# Altium schematic sheet Sheet1.SchDoc
size 381 x 241 mm; SheetNumber: 1; SheetTotal: 1
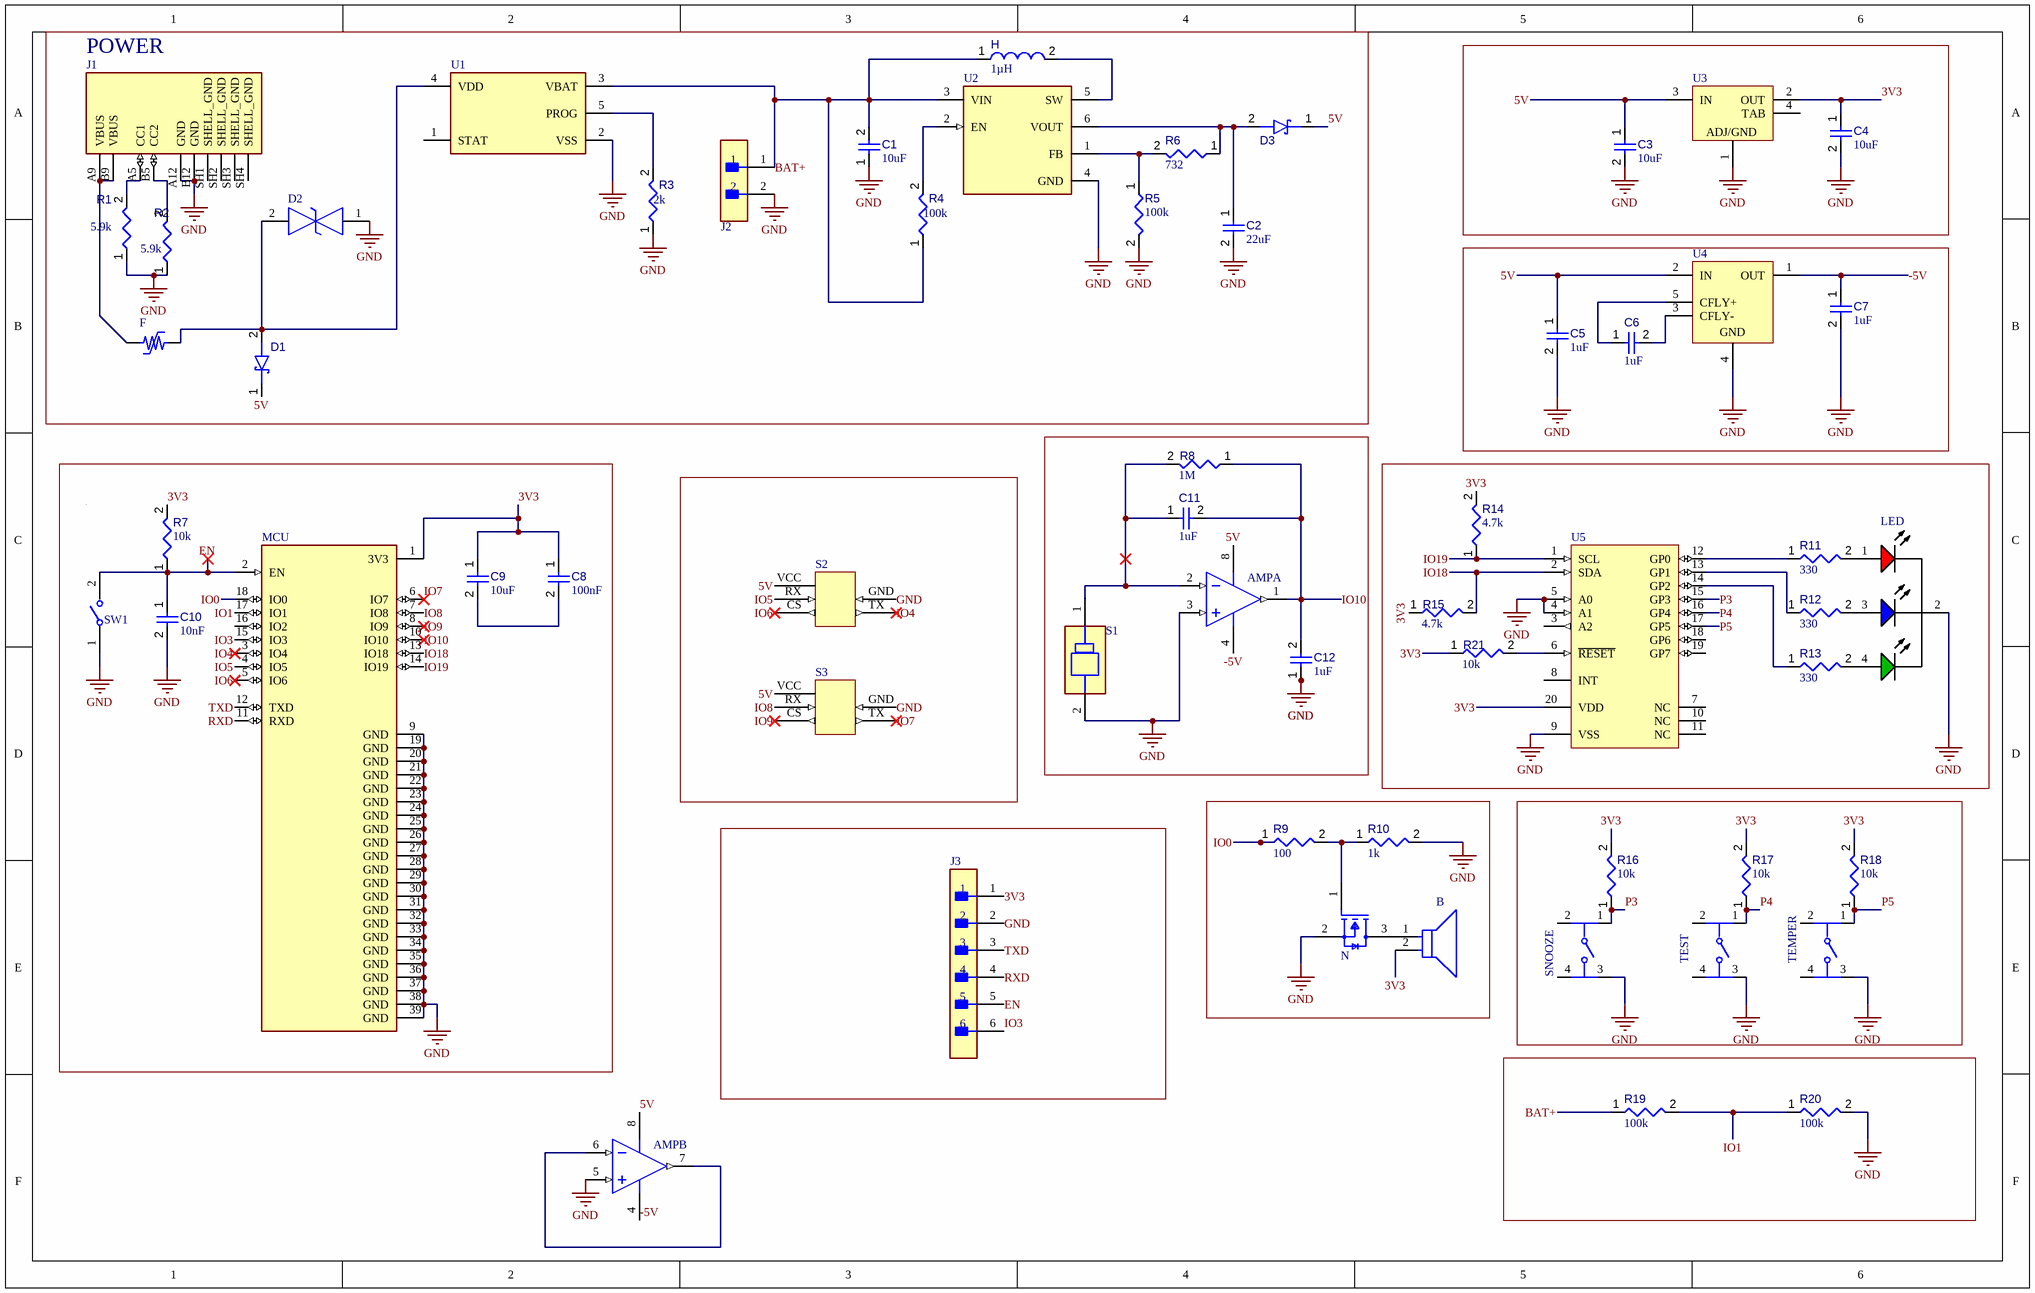
[diagram p0: Sheet1.SchDoc]

## Parts
AMP  AD708SQ/883B  [ADI-Q-8]  (value not drawn)  (parts A,B of 2)
B  PS1740P02E  [FP-PS1740P02E-MFG]  (value not drawn)
C1  value 10uF  [CAPC0402(1005)33_L]  (hidden comment: Capacitor 1nF +/-20% 50V 0402)
C2  value 22uF  [CAPC0402(1005)33_L]  (hidden comment: Capacitor 1nF +/-20% 50V 0402)
C3  value 10uF  [CAPC0402(1005)33_L]  (hidden comment: Capacitor 1nF +/-20% 50V 0402)
C4  value 10uF  [CAPC0402(1005)33_L]  (hidden comment: Capacitor 1nF +/-20% 50V 0402)
C5  value 1uF  [CAPC0402(1005)33_L]  (hidden comment: Capacitor 1nF +/-20% 50V 0402)
C6  value 1uF  [CAPC0402(1005)33_L]  (hidden comment: Capacitor 1nF +/-20% 50V 0402)
C7  value 1uF  [CAPC0402(1005)33_L]  (hidden comment: Capacitor 1nF +/-20% 50V 0402)
C8  value 100nF  [CAPC0402(1005)33_L]  (hidden comment: Capacitor 1nF +/-20% 50V 0402)
C9  value 10uF  [CAPC0402(1005)33_L]  (hidden comment: Capacitor 1nF +/-20% 50V 0402)
C10  value 10nF  [CAPC0402(1005)33_L]  (hidden comment: Capacitor 1nF +/-20% 50V 0402)
C11  value 1uF  [CAPC0402(1005)33_L]  (hidden comment: Capacitor 1nF +/-20% 50V 0402)
C12  value 1uF  [CAPC0402(1005)33_L]  (hidden comment: Capacitor 1nF +/-20% 50V 0402)
D1  RB520CM-30  [ROHM-VMN2-2_V]  (value not drawn)
D2  ESD05V88D-LC  [ESD05V88DLC]  (value not drawn)
D3  RB520CM-30  [ROHM-VMN2-2_V]  (value not drawn)
F  MF-MSMF075-2  [BOUR-MF-MSMF050-2_V]  (value not drawn)
H  value 1µH  [TDK-VLCF5028-2_V]  (hidden comment: VLCF5028T-2R7N1R8-2)
J1  USB4970-00-A_REVA  [GCT_USB4970-00-A_REVA]  (value not drawn)
J2  B02P-VL (LF)(SN)  [FP-B02P-VL_LF_SN-MFG]  (value not drawn)
J3  MTSW-106-22-L-S-409  [FP-MTSW-106-22-L-S-409-MFG]  (value not drawn)
LED  WP154A4SUREQBFZGC  [KING-WP154A4SUREQBFZGC_V]  (value not drawn)
MCU  ESP32-C3-WROOM-02-H4  [MODULE_ESP32-C3-WROOM-02-H4]  (value not drawn)
N  AO3400A  [FP-SOT23-MFG]  (value not drawn)
R1  value 5.9k  [RESC0402(1005)_L]  (hidden comment: Resistor 100K +/-1 % 0402 63 mW)
R2  value 5.9k  [RESC0402(1005)_L]  (hidden comment: Resistor 100K +/-1 % 0402 63 mW)
R3  value 2k  [RESC0402(1005)_L]  (hidden comment: Resistor 100K +/-1 % 0402 63 mW)
R4  value 100k  [RESC0402(1005)_L]  (hidden comment: Resistor 100K +/-1 % 0402 63 mW)
R5  value 100k  [RESC0402(1005)_L]  (hidden comment: Resistor 100K +/-1 % 0402 63 mW)
R6  value 732  [RESC0402(1005)_L]  (hidden comment: Resistor 100K +/-1 % 0402 63 mW)
R7  value 10k  [RESC0402(1005)_L]  (hidden comment: Resistor 100K +/-1 % 0402 63 mW)
R8  value 1M  [RESC0402(1005)_L]  (hidden comment: Resistor 100K +/-1 % 0402 63 mW)
R9  value 100  [RESC0402(1005)_L]  (hidden comment: Resistor 100K +/-1 % 0402 63 mW)
R10  value 1k  [RESC0402(1005)_L]  (hidden comment: Resistor 100K +/-1 % 0402 63 mW)
R11  value 330  [RESC0402(1005)_L]  (hidden comment: Resistor 100K +/-1 % 0402 63 mW)
R12  value 330  [RESC0402(1005)_L]  (hidden comment: Resistor 100K +/-1 % 0402 63 mW)
R13  value 330  [RESC0402(1005)_L]  (hidden comment: Resistor 100K +/-1 % 0402 63 mW)
R14  value 4.7k  [RESC0402(1005)_L]  (hidden comment: Resistor 100K +/-1 % 0402 63 mW)
R15  value 4.7k  [RESC0402(1005)_L]  (hidden comment: Resistor 100K +/-1 % 0402 63 mW)
R16  value 10k  [RESC0402(1005)_L]  (hidden comment: Resistor 100K +/-1 % 0402 63 mW)
R17  value 10k  [RESC0402(1005)_L]  (hidden comment: Resistor 100K +/-1 % 0402 63 mW)
R18  value 10k  [RESC0402(1005)_L]  (hidden comment: Resistor 100K +/-1 % 0402 63 mW)
R19  value 100k  [RESC0402(1005)_L]  (hidden comment: Resistor 100K +/-1 % 0402 63 mW)
R20  value 100k  [RESC0402(1005)_L]  (hidden comment: Resistor 100K +/-1 % 0402 63 mW)
R21  value 10k  [RESC0402(1005)_L]  (hidden comment: Resistor 100K +/-1 % 0402 63 mW)
S1  TGS5141-P00  [FP-TGS5141-P00-MFG]  (value not drawn)
S2  C1N_2654_40D-Symbol-1  [C1N_2654_40D.PcbLib]  (value not drawn)
S3  C1N_2654_40D-Symbol-1  [C1N_2654_40D.PcbLib]  (value not drawn)
SNOOZE  B3F-1006  [FP-B3F-1006-MFG]  (value not drawn)
SW1  B3U-1000P  [FP-B3U-1000P-MFG]  (value not drawn)
TEMPER  B3F-1006  [FP-B3F-1006-MFG]  (value not drawn)
TEST  B3F-1006  [FP-B3F-1006-MFG]  (value not drawn)
U1  MCP73831T-2ACI/OT  [FP-C04-091-OT-IPC_B]  (value not drawn)
U2  TPS61023DRLR  [FP-DRL0006A-MFG]  (value not drawn)
U3  NCP1117ST33T3G  [ONSC-SOT-223-4-318H-01_A_V]  (value not drawn)
U4  TPS60403DBVRG4  [TI-DBV5_M]  (value not drawn)
U5  MCP23008-E/SS  [SSOP-SS20_N]  (value not drawn)

## Blocks framed on the sheet
POWER: C1 C2 D1-D3 F H J1 J2 R1-R6 U1 U2

## Nets
GND: AMP.3(+IN_A) AMP.5(+IN_B) C1.1 C2.2 C3.2 C4.2 C5.2 C7.2 C10.2 C12.1 D2.1 J1.A12(GND) J1.B12(GND) J2.2 J3.2 LED.2(CATHODE) MCU.9(GND) MCU.19(GND) MCU.20(GND) MCU.21(GND) MCU.22(GND) MCU.23(GND) MCU.24(GND) MCU.25(GND) MCU.26(GND) MCU.27(GND) MCU.28(GND) MCU.29(GND) MCU.30(GND) MCU.31(GND) MCU.32(GND) MCU.33(GND) MCU.34(GND) MCU.35(GND) MCU.36(GND) MCU.37(GND) MCU.38(GND) MCU.39(GND) N.2(S) R1.1 R2.1 R3.1 R5.2 R10.2 R20.2 S1.2(Counter) S2.GND S3.GND SNOOZE.3 SW1.1 TEMPER.3 TEST.3 U1.2(VSS) U2.4(GND) U3.1(ADJ/GND) U4.4(GND) U5.4(A1) U5.5(A0) U5.9(VSS)
3V3: B.2 C4.1 C8.1 C9.1 J3.1 MCU.1(3V3) R7.2 R14.2 R15.1 R16.2 R17.2 R18.2 R21.1 U3.2(OUT) U5.20(VDD)
5V: AMP.8(+VS) C3.1 C5.1 D1.1(K) D3.1(K) S2.VCC S3.VCC U3.3(IN) U4.2(IN)
-5V: AMP.4(-VS) C7.1 U4.1(OUT)
BAT+: C1.2 H.1 J2.1 R4.1 R19.1 U1.3(VBAT) U2.3(VIN)
EN: C10.1 J3.5 MCU.2(EN) R7.1 SW1.2
IO0: MCU.18(IO0) R9.1
IO1: MCU.17(IO1) R19.2 R20.1
IO3: J3.6 MCU.15(IO3)
IO4: MCU.3(IO4) S2.TX
IO5: MCU.4(IO5) S2.RX
IO6: MCU.5(IO6) S2.CS
IO7: MCU.6(IO7) S3.TX
IO8: MCU.7(IO8) S3.RX
IO9: MCU.8(IO9) S3.CS
IO10: AMP.1(OUT_A) C11.2 C12.2 MCU.10(IO10) R8.1
IO18: MCU.13(IO18) R15.2 U5.2(SDA)
IO19: MCU.14(IO19) R14.1 U5.1(SCL)
P3: R16.1 SNOOZE.1 U5.15(GP3)
P4: R17.1 TEST.1 U5.16(GP4)
P5: R18.1 TEMPER.1 U5.17(GP5)
RXD: J3.4 MCU.11(RXD)
TXD: J3.3 MCU.12(TXD)
NetAMP_2: AMP.2(-IN_A) C11.1 R8.2 S1.1(Working)
NetAMP_6: AMP.6(-IN_B) AMP.7(OUT_B)
NetB_1: B.1 N.3(D)
NetC2_1: C2.1 D3.2(A) R6.1 U2.6(VOUT)
NetC6_1: C6.1 U4.5(CFLY+)
NetC6_2: C6.2 U4.3(CFLY-)
NetC8_2: C8.2 C9.2
NetD1_2: D1.2(A) D2.2 F.2 U1.4(VDD)
NetF_1: F.1 J1.A9(VBUS) J1.B9(VBUS)
NetH_2: H.2 U2.5(SW)
NetJ1_A5: J1.A5(CC1) R1.2
NetJ1_B5: J1.B5(CC2) R2.2
NetLED_1: LED.1(RED) R11.2
NetLED_3: LED.3(BLUE) R12.2
NetLED_4: LED.4(GREEN) R13.2
NetN_1: N.1(G) R9.2 R10.1
NetR3_2: R3.2 U1.5(PROG)
NetR4_2: R4.2 U2.2(EN)
NetR5_1: R5.1 R6.2 U2.1(FB)
NetR11_1: R11.1 U5.12(GP0)
NetR12_1: R12.1 U5.13(GP1)
NetR13_1: R13.1 U5.14(GP2)
NetR21_2: R21.2 U5.6(~{RESET})

Not connected (* = marked no-connect by the designer): J1 SH1(SHELL_GND) SH2(SHELL_GND) SH3(SHELL_GND) SH4(SHELL_GND); MCU 16(IO2); SNOOZE 2 4; TEMPER 2 4; TEST 2 4; U1 1(STAT); U3 4(TAB); U5 3(A2) 7(NC) 8(INT) 10(NC) 11(NC) 18(GP6) 19(GP7)

## Library data of the parts
AMP = CMP-0384-00320-1: Double Channel Very High DC Precision Operational Amplifier, 900KHz BW, 300 mV/us SR, Military, 8-pin DIP (Q-8), Tube; Generic Part Number: AD708; Manufacturer: Analog Devices; Input Bias Current: 0.5nA; Iq/Amp: 2.75mA; Amplifiers Per Package: 2; Input Offset Voltage: 5uV; V Span Min: 6V; V Span Max: 36V; PartNumber: AD708SQ/883B; Small Signal Bandwidth: 900KHz; DatasheetVersion: Rev. C; ComponentLink2Description: Datasheet; PackageReference: Q-8; ComponentLink3Description: Package Specification; Slew Rate: 300mV/us; Mounting Technology: Through Hole; ComponentLink1Description: Manufacturer URL; Packing: Tube; ComponentLink3URL: http://www.analog.com/static/imported-files/packages/3925655241313314758Q_8.pdf; PackageDescription: 8-Pin Ceramic Dual In-Line Package, Row spacing 7.62 mm, Pitch 2.54 mm; ComponentLink1URL: http://www.analog.com/en/index.html; ComponentLink2URL: http://www.analog.com/static/imported-files/data_sheets/AD708.pdf
B = CMP-08413-000002-1: AUDIO PIEZO TRANSDUCER 30V TH; Voltage Rating: 3V; Washable: No; Frequency: 4kHz; Package Quantity: 1500; Packaging: Bulk; Lead Free: Lead Free; Diameter: 17mm; Series: PS; Height: 7.5mm; Max Operating Temperature: 70°C; Mount: Through Hole; Min Operating Temperature: -10°C; Operating Supply Voltage: 3V; Termination: PC Pins; RoHS Compliant: Yes
C1-C12 = CMP-001-00066-3: Chip Capacitor, 1nF +/-20%, 50V, 0402, Thickness 0.33 mm; Tolerance: 10%; Case/Package: 0402; Pins: 2; Min Operating Temperature: -55°C; Max Operating Temperature: 85°C; Voltage Rating: 50V; Mounting Technology: SMT
D1 D3 = CMP-004-00028-3: DIODE SCHOTTKY 30V 100MA VMN2M; Case/Package: SMD/SMT; Pins: 2; Mounting Technology: SMT
D2 = CMP-004-00032-1: Bi-directional TVS Diode for ESD Protection; Manufacturer_Name: SOCAY Elec; Geometry.Height: 0.55mm; Mouser Part Number: *; Arrow Part Number: *; Datasheet Link: https://datasheet.lcsc.com/szlcsc/1902141130_SOCAY-Elec-ESD05V88D-LC_C303803.pdf; Design Item ID: ESD05V88D-LC; Manufacturer_Part_Number: ESD05V88D-LC; Mouser Price/Stock: *; Source: ESD05V88D-LC.SchLib; Arrow Price/Stock: *
F = CMP-005-00002-4: PTC Resettable Fuse, 13.2 V, 750 mA, -40 to 85 degC, 2-Pin SMD, RoHS, Tape and Reel; Manufacturer: Bourns; Resistance: 450mohm; Current Rating: 100A; Voltage Rating: 13.2V; Package Reference: MF-MSMF050-2; Mounting Technology: SM; Max Operating Temperature: 85°C; Package Quantity: 2000; Min Operating Temperature: -40°C; Case/Package: 1812; Packaging: TapeandReel; Package Description: 2-Pin Surface Mount Device, Body 4.55 x 3.24 mm; Lead Pitch: 4.73mm; Nominal Supply Voltage: 13.2V; Datasheet Version: Rev. AG, 08/2016; Datasheet URL: http://www.bourns.com/docs/Product-Datasheets/mfmsmf.pdf; RoHS Compliant: True
H = CMP-006-00017-6: Inductor for Power Circuits, 2.7 uH, +/- 30%,100 KHz, 1.82 A, -40 to 105 degC, 2-Pin SMD, RoHS, Reel; Manufacturer: TDK; Resistance: 0.033Ohm; Shielding: Shielded; Core Material: Ferrite; Current Rating: 1.82A; Tolerance: 30%; Package Quantity: 500; Datasheet Version: Apr-16; Max Operating Temperature: 105°C; RoHS Compliant: True; Min Operating Temperature: -40°C; Datasheet URL: https://product.tdk.com/info/en/catalog/datasheets/inductor_commercial_power_vlcf5028-2_en.pdf; Packaging: TapeandReel; Package Description: 2-Pin Surface Mount Device, Body 5.2 x 5.3 mm; Mounting Technology: SM; Saturation Current: 1.82A; Inductance Tolerance: 30%; Package Reference: VLCF5028-2; Case/Package: 5028
J1 = CMP-002-00071-1: Type C USB Charging Connector; MF: Global Connector Technology; Design Item ID: USB4970-00-A_REVA; Value: *; Case/Package: None; Check_prices: https://www.snapeda.com/parts/USB4970-00-A/Global+Connector+Technology/view-part/?ref=eda; Pins: 10; Component Type: Standard; SnapEDA_Link: https://www.snapeda.com/parts/USB4970-00-A/Global+Connector+Technology/view-part/?ref=snap; Source: USB4970-00-A_REVA.SchLib; MP: USB4970-00-A
J2 = CMP-17439-000534-1: VL Series, Series Number B02P, 6.2mm Pitch 2 Way 1 Row Straight PCB Header, Through Hole Termination, 20A; Number of Contacts: 2; Voltage Rating: 600V; Contact Material: Copper Alloy; Pitch: 6.2mm; Number of Rows: 1; Termination: Through Hole; Series: VL; Orientation: Straight; Current Rating: 20A
J3 = CMP-02766-001492-1: Headers & Wire Housings Variable Height PCB HDR Strps, 0.100" Pitch
LED = CMP-2000-07415-1: Full Color LED Lamp, Dominant Wavelength RGB 630 / 525 / 465 nm, -40 to 85 degC, 4-Pin THD, RoHS; Manufacturer: Kingbright; Viewing Angle: 50°; Wavelength - Dominant: 630nm,525nm,465nm; Online Catalog: 5mm,T-13/4(RGB)RoundwithDomedTopLEDLamp; Millicandela Rating: 1300mcdRed,1700mcdGreen,900mcdBlue; Other Names: 754-1615 / WP154A4SUREQBFZGC-ND; Current - Test: 20mA; Wavelength - Peak: 645nm,515nm,460nm; Voltage - Forward (Vf) (Typ): 1.9VRed,3.3VGreen,3.3VBlue; Lens Type: Clear; 3D Model: WP154A4SUREQBFZGW.sldprt / WP154A4SUREQBFZGW.pro / WP154A4SUREQBFZGW.igs / WP154A4SUREQBFZGW.stp; Lens Style/Size: RoundwithDomedTop,5mm,T-13/4; Packaging: Bulk; Datasheet URL: https://www.kingbrightusa.com/images/catalog/spec/WP154A4SUREQBFZGC.pdf; Family: LEDIndication-Discrete; Color: Red,Green,Blue(RGB); Datasheet Version: Rev. 5A, 08/2014; Category: Optoelectronics; Manufacturer URL: http://www.kingbright.com/; Height: 8.60mm; Mounting Type: ThroughHole; Package Reference: WP154A4SUREQBFZGC; Mounting Technology: ThroughHole; Package Description: 4-Pin Through Hole LED, Dia 5.9 mm, Pitch 1.27 mm; Standard Package: 500; Package / Case: Radial-4Leads
MCU = CMP-031-00006-1: WiFi Modules (802.11) (Engineering Samples) SMD module, ESP32-C3, 4MB SPI flash, PCB antenna, -40 C +105 C; MF: Espressif Systems; Design Item ID: ESP32-C3-WROOM-02-H4; SnapEDA_Link: https://www.snapeda.com/parts/ESP32-C3-WROOM-02-H4/Espressif+Systems/view-part/?ref=snap; Source: ESP32-C3-WROOM-02-H4.SchLib; Check_prices: https://www.snapeda.com/parts/ESP32-C3-WROOM-02-H4/Espressif+Systems/view-part/?ref=eda; MP: ESP32-C3-WROOM-02-H4; Pins: 39; Component Type: Standard; Case/Package: Package; Value: *
N = CMP-83955-000006-1: MOSFET N-CH 30V 5.7A SOT23; Input Capacitance: 630pF; Number of Elements: 1; Rds On Max: 26.5mR; Max Power Dissipation: 1.4W; Gate to Source Voltage (Vgs): 12V; Min Operating Temperature: -55°C; Lead Free: Lead Free; Number of Pins: 3; Drain to Source Voltage (Vdss): 30V; Case/Package: SOT-23; Mount: Surface Mount; Continuous Drain Current (ID): 5.7A; Radiation Hardening: No; Packaging: Tape and Reel; Max Operating Temperature: 150°C; Power Dissipation: 1.4W
R1-R21 = CMP-009-00168-3: Chip Resistor, 100 kOhms, +/-1 %, 63 mW, -55 to 155 degC, 0402; Tolerance: 1%; Power: 63mW; Max Operating Temperature: 155°C; Min Operating Temperature: -55°C; Pins: 2; Case/Package: 0402
S1 = CMP-216788-000002-1: SENSOR CARBON MONOXIDE; Manufacturer: Figaro; Sensor Output: Analog Voltage; Temperature Range High: +50°C; ComponentLink2Description: Datasheet; Octopart: https://octopart.com/tgs5141-p00-figaro-103046867; Height: 7.1mm; Automotive: No; Device Class L3: unset; Temperature Range Low: -10°C; Device Class L1: Sensors; Package: 0; ComponentLink2URL: https://forum.upverter.com/uploads/short-url/yw5D0XICcjAZudgy1tuLKAt05WH.pdf; Category: IC; Temperature: -10°C to +50°C; Manufacturer Part Number: TGS5141-P00; Device Class L2: unset
S2 S3 = CMP-030-000000-1: Source: C1N-2654-40D.SchLib; Design Item ID: C1N_2654_40D-Symbol-1
SNOOZE TEMPER TEST = CMP-08834-000047-1: SWITCH TACTILE SPST-NO 0.05A 24V; Mechanical Life: 50000Cycles; Operating Force: 4.9N; Actuator Length: 0.9mm; Illumination Type: Non-Illuminated; Actuator Type: Standard; Contact Current Rating: 50mA; Number of Poles: 1; Contact Resistance: 100mR; Throw Configuration: SPST; Ratings: IP00; Switch Travel: 0.25mm; Switch Function: Off-Mom; Actuator Color: Red; Orientation: Straight; Height: 4.3mm; Voltage Rating (DC): 24V; Contact Plating: Silver; Depth: 6mm; Width: 6mm; Series: B3F; Min Operating Temperature: -25°C; Length: 6mm; Packaging: Bag; Max Operating Temperature: 70°C; Max Voltage Rating (DC): 24V; Weight: 0.25g; Termination: PC Pins; Max Current Rating: 50mA; Package Quantity: 1500; Mount: Through Hole; Current Rating: 50mA; Lead Free: Lead Free; Contact Material: Gold; Electrical Life: 50000Cycles
SW1 = CMP-2100-03586-2: SWITCH TACTILE SPST-NO 0.05A 12V; Contact Resistance: 100mR; Operating Force: 1.5N; Max Current Rating: 50mA; Switch Travel: 0.15mm; Actuator Type: Standard; Mechanical Life: 200000Cycles; Ratings: Dust Proof; Illumination Type: Non-Illuminated; Throw Configuration: SPST; Actuator Length: 0.4mm; Switch Function: Off-Mom; Height: 1.2mm; Width: 3mm; Weight: 0.000776oz; Contact Material: Silver; Max Voltage Rating (DC): 12V; Insulation Resistance: 100MR; Lead Free: Lead Free; Current Rating: 50mA; Termination: SMD/SMT; Length: 4mm; Voltage Rating (DC): 12V; Contact Current Rating: 50mA; Orientation: Straight; Depth: 2.5mm; Max Operating Temperature: 70°C; Packaging: Tape and Reel; Min Operating Temperature: -25°C; Package Quantity: 1; Mount: Surface Mount; Electrical Life: 200000Cycles
U1 = CMP-0133-00143-2: IC CONTROLLR LI-ION 4.2V SOT23-5; Max Power Dissipation: 1.54W; Output Current: 500mA; Max Output Voltage: 4.5V; Number of Outputs: 1; Min Output Voltage: 4.168V; Min Supply Voltage: 3.75V; Max Input Voltage: 6V; Voltage Rating: 4.534V; Drain to Source Resistance: 350mR; Max Operating Temperature: 85°C; Length: 0.122inch; Number of Pins: 5; REACH SVHC: No SVHC; Radiation Hardening: No; Min Operating Temperature: -40°C; Weight: 0.00709oz; Contact Plating: Tin; Termination: SMD/SMT; Case/Package: SOT-23; Mount: Surface Mount; Width: 0.071inch; Packaging: Tape and Reel; Number of Cells: 1; Max Charge Current: 500mA; Height: 0.051inch; Number of Channels: 1; Output Voltage: 4.2V; Max Supply Voltage: 6V; Lead Free: Lead Free
U2 = CMP-04918-000638-1: FINISH GOODS FOR TPS61023
U3 = CMP-019-00030-3: Low-Dropout Positive Fixed Voltage Regulator, 1 A, 3.3 V Output Voltage, 0 to 125 degC, 4-Pin SOT-223 (318H-01), Pb-Free, Tape and Reel; Manufacturer: ON Semiconductor; Max Supply Voltage: 15V; Min Input Voltage: 3.5V; Max Ouput Current: 1A; Output Voltage: 3.3V; Outputs: 1; Min Supply Voltage: 4.75V; Max Input Voltage: 20V; Dropout Voltage: 1.1V; Package Reference: SOT-223-4-318H-01_A; Package Quantity: 4000; Manufacturer URL: http://www.onsemi.com/; Mounting Technology: SM; Output Current: 1A; Min Operating Temperature: 0°C; Datasheet URL: http://www.onsemi.com/pub_link/Collateral/NCP1117-D.PDF; RoHS Compliant: True; Pins: 3; Case/Package: SOT-223-4; Packaging: TapeandReel; Max Operating Temperature: 125°C; Package Description: 4-Pin Small Outline Transistor, Body 6.5 x 3.5 mm, Pitch 2.3 mm; Nominal Output Voltage: 3.3V; Datasheet Version: Rev. 27, 09/2014
U4 = CMP-0391-00007-1: -1.8 to -5.25 V, Inverting Charge Pump Regulator, 60 mA, 1.8 to 5.25 V Input with 2-Cell Alkaline / Nixx Input, -40 to 85 degC, 5-pin SOT23 (DBV5), Green (RoHS & no Sb/Br); Manufacturer: Texas Instruments; 2-Cell Alkaline/Nixx Input: TRUE; Efficiency(Typ)(%): 99; Vin(Max)(V): 5.25; Switching Frequency(Max)(kHz): 300; Vin(Min)(V): 1.8; Iout(Max)(A): 0.06; Topology: Inverting Buck/Boost; Iq(Typ)(mA): 0.425; ComponentLink2URL: http://www.ti.com/general/docs/lit/getliterature.tsp?genericPartNumber=TPS60403&fileType=pdf; PackageDescription: 5-Pin Plastic Small Outline, Body 1.60 Ãƒâ€” 2.90 mm, Pitch 0.95 mm; Mounting Technology: Surface Mount; ComponentLink2Description: Datasheet; Code_JEDEC: MO-178; DatasheetVersion: SLVS324A; PackageVersion: 4073253-4/K; ComponentLink3Description: Package Specification; ComponentLink3URL: http://www.ti.com/litv/pdf/mpds018i; Vout(Min)(V): -1.8; Eco-Plan: Green (RoHS & no Sb/Br); ComponentLink1URL: http://www.ti.com/; PartNumber: TPS60403DBVRG4; PackageReference: DBV5; Vout(Max)(V): -5.25; ComponentLink1Description: Manufacturer URL
U5 = CMP-0186-00169-3: 8-Bit I/O Expander with Serial Interface, 20-Pin SSOP, Extended Temperature; PackageVersion: revBB, Aug-2009; Code_JEDEC: MO-150; ComponentLink3URL: http://www.microchip.com/stellent/groups/techpub_sg/documents/packagingspec/en012702.pdf; PackageReference: SSOP-SS20; ComponentLink2Description: Datasheet; ComponentLink1URL: http://www.microchip.com/; ComponentLink2URL: http://ww1.microchip.com/downloads/en/DeviceDoc/21919e.pdf; RevisionNote: Sch corrected.; PackageDescription: 20-Lead Plastic Shrink Small Outline (SS) - 5.3mm Body [SSOP]; ComponentLink1Description: Manufacturer URL; ComponentLink3Description: Package Specification; DatasheetVersion: revE, Aug-2007